# EAGLE design Rev1.0 (EAGLE 8.7.1)
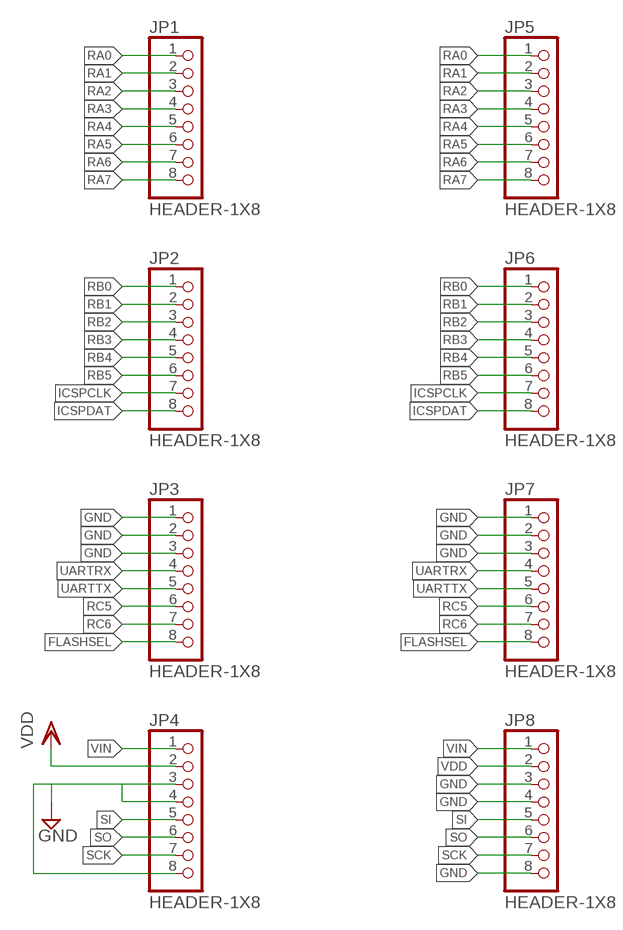
[diagram p0: schematic, sheet 1]

## Parts
JP1  HEADER-1X8  [1X08]
JP2  HEADER-1X8  [1X08]
JP3  HEADER-1X8  [1X08]
JP4  HEADER-1X8  [1X08]
JP5  HEADER-1X8  [1X08]
JP6  HEADER-1X8  [1X08]
JP7  HEADER-1X8  [1X08]
JP8  HEADER-1X8  [1X08]

## Nets
FLASHSEL: JP3.8 JP7.8
GND: JP3.1 JP3.2 JP3.3 JP4.3 JP4.4 JP4.8 JP7.1 JP7.2 JP7.3 JP8.3 JP8.4 JP8.8
ICSPCLK: JP2.7 JP6.7
ICSPDAT: JP2.8 JP6.8
RA0: JP1.1 JP5.1
RA1: JP1.2 JP5.2
RA2: JP1.3 JP5.3
RA3: JP1.4 JP5.4
RA4: JP1.5 JP5.5
RA5: JP1.6 JP5.6
RA6: JP1.7 JP5.7
RA7: JP1.8 JP5.8
RB0: JP2.1 JP6.1
RB1: JP2.2 JP6.2
RB2: JP2.3 JP6.3
RB3: JP2.4 JP6.4
RB4: JP2.5 JP6.5
RB5: JP2.6 JP6.6
RC5: JP3.6 JP7.6
RC6: JP3.7 JP7.7
SCK: JP4.7 JP8.7
SI: JP4.5 JP8.5
SO: JP4.6 JP8.6
UARTRX: JP3.4 JP7.4
UARTTX: JP3.5 JP7.5
VDD: JP4.2 JP8.2
VIN: JP4.1 JP8.1

## Library data of the parts
JP1-JP8 = lib-works:HEADER-1X8

## Board
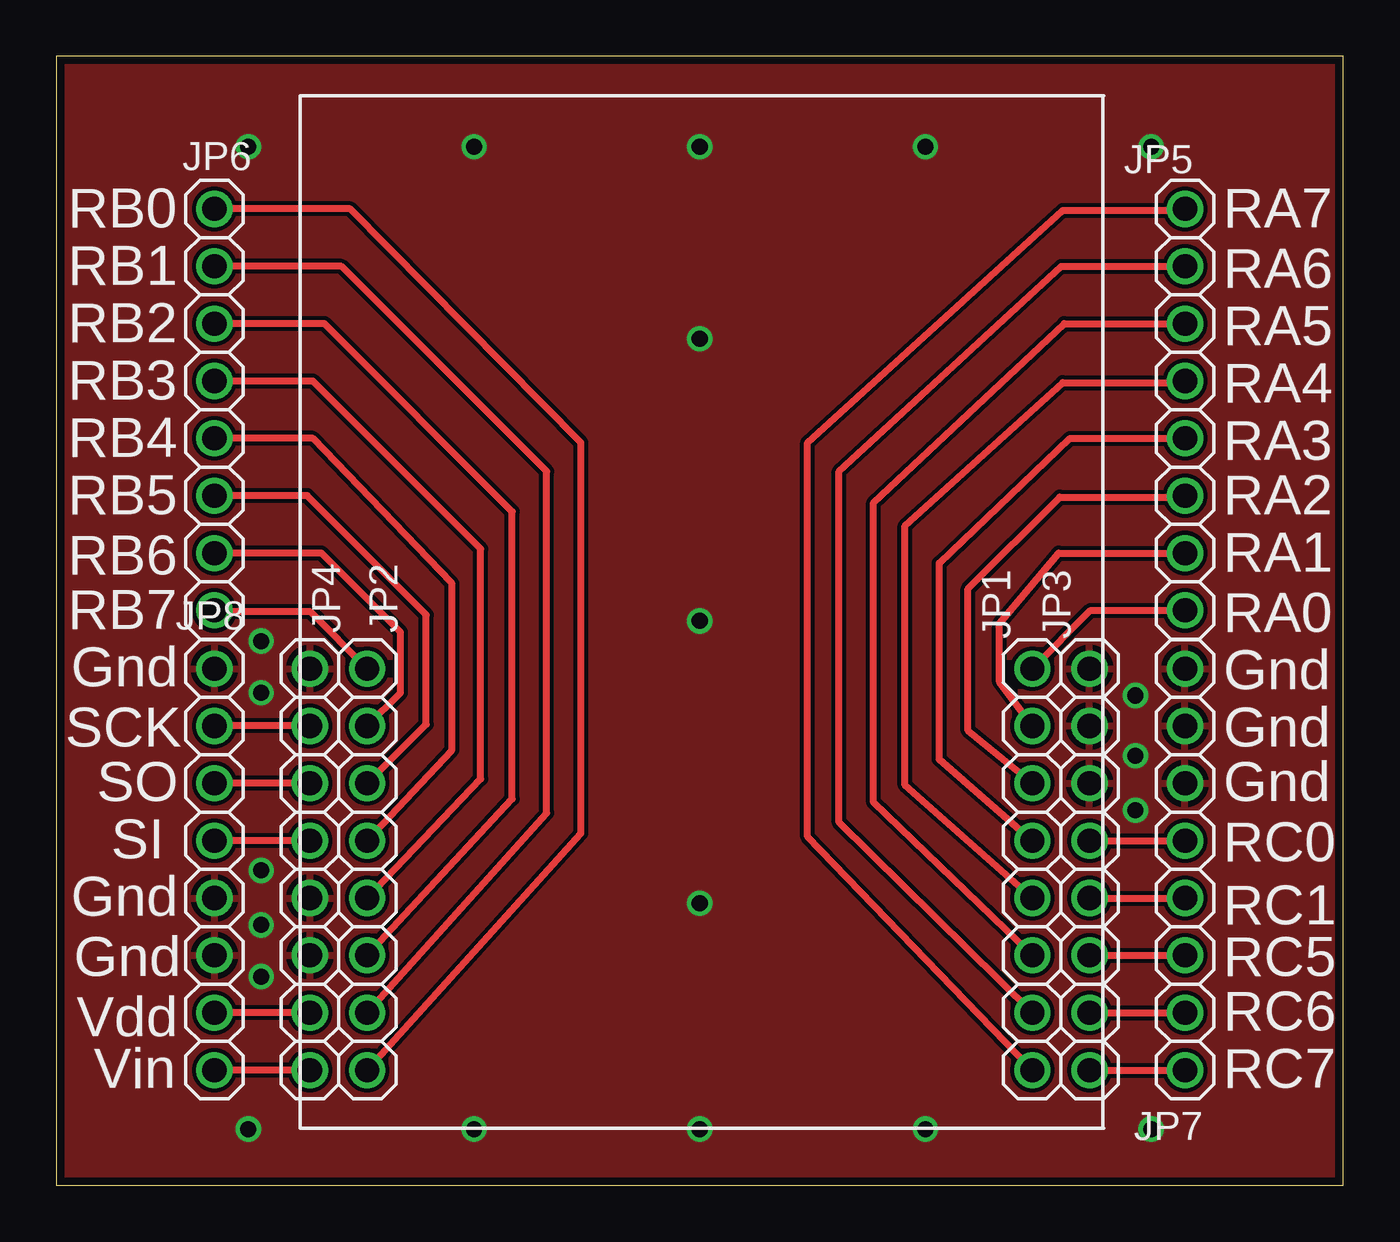
[diagram p1: board, top side]
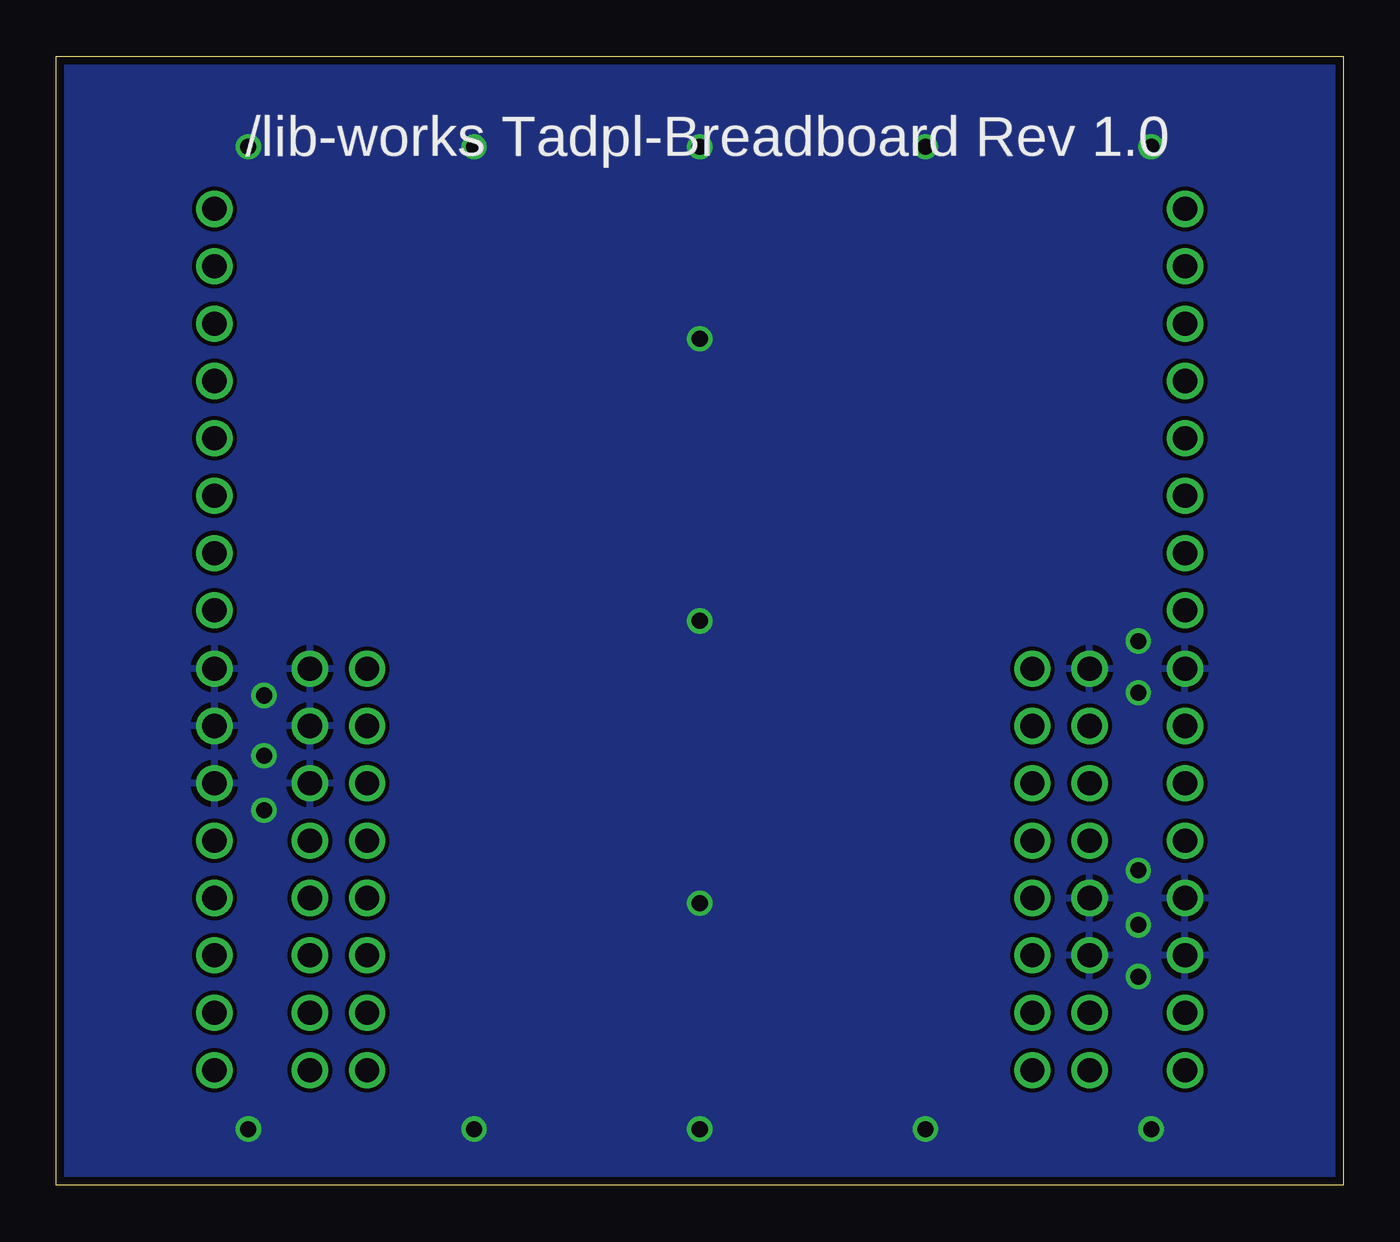
[diagram p2: board, bottom side, seen from below]

Size 57 x 50 mm. Coordinates in mm from the lower left corner, seen from the top.
Outline: 0,0 57,0 57,50 0,50 0,0
Copper layers (1*16): Top 0.035mm / dielectric 1.5mm / Bottom 0.035mm
Design rules "default *": minimum track width 7mil, minimum drill 0.35mm, track to track 7mil, track to pad 7mil, pad to pad 7mil, via to via 7mil, smd to smd 7mil, copper to edge 14mil, drill to drill 6mil, minimum pad ring 10mil, minimum via ring 8mil, stop-mask expansion 4mil, vias tented up to drill 0mil, thermal gap 10mil

### Footprints (pad centres in the part's own frame; a part is rotated, then mirrored left to right if it is on the bottom)
1X08 = drill 1.067: 1 -8.89,0; 2 -6.35,0; 3 -3.81,0; 4 -1.27,0; 5 1.27,0; 6 3.81,0; 7 6.35,0; 8 8.89,0

### Placement (x,y rotation side)
JP1  43.23,14 270 top
JP2  13.77,14 90 top
JP3  45.77,14 270 top
JP4  11.23,14 90 top
JP5  50,34.36 90 top
JP6  7,34.36 270 top
JP7  50,14 270 top
JP8  7,14 90 top

### Tracks (layer width: path | path; a pad name or v marks a point on that pad's centre or on a via)
FLASHSEL
  Top 0.305: JP3.8 JP7.8
GND  (via drill 0.71)
  other vias: 28.5,46 18.5,46 8.5,46 38.5,46 48.5,46 28.5,37.5 28.5,25 28.5,12.5 8.5,2.5 18.5,2.5 28.5,2.5 38.5,2.5 48.5,2.5 47.8,21.7 47.8,19.03 47.8,16.62 9.07,24.11 9.07,21.82 9.07,13.95 9.07,11.54 9.07,9.25
  pour Bottom: -2.16,51.44 -2.16,-2.29 58.55,-2.03 58.55,51.44
  pour Top: -1.91,51.56 -1.91,-1.91 59.44,-1.91 59.44,51.56
ICSPCLK
  Top 0.305: JP2.7 15.24,21.82 15.24,24.51 11.74,28.01 JP6.7
ICSPDAT
  Top 0.305: JP2.8 11.26,25.4 7.07,25.4 JP6.8
RA0
  Top 0.305: JP1.1 45.81,25.47 JP5.1
RA1
  Top 0.305: JP1.2 41.78,22.3 41.78,24.89 44.39,28.01 JP5.2
RA2
  Top 0.305: JP1.3 40.39,20.15 40.39,26.42 44.45,30.48 49.93,30.48 JP5.3
RA3
  Top 0.305: JP1.4 39.12,18.88 39.12,27.56 44.9,33.09 JP5.4
RA4
  Top 0.305: JP1.5 37.59,17.73 37.59,29.21 44.58,35.56 49.93,35.56 JP5.5
RA5
  Top 0.305: JP1.6 36.2,16.97 36.2,30.23 44.64,38.17 JP5.6
RA6
  Top 0.305: JP1.7 34.67,16.08 34.67,31.62 44.52,40.71 JP5.7
RA7
  Top 0.305: JP1.8 33.27,15.45 33.27,32.89 44.58,43.18 49.93,43.18 JP5.8
RB0
  Top 0.305: JP2.1 23.24,15.6 23.24,32.89 13.01,43.25 JP6.1
RB1
  Top 0.305: JP2.2 21.72,16.49 21.72,31.62 12.63,40.71 JP6.2
RB2
  Top 0.305: JP2.3 20.19,17.12 20.19,29.84 11.87,38.17 JP6.3
RB3
  Top 0.305: JP2.4 18.8,18.01 18.8,28.19 11.36,35.63 JP6.4
RB4
  Top 0.305: JP2.5 17.53,19.28 17.53,26.67 11.36,33.09 JP6.5
RB5
  Top 0.305: JP2.6 16.38,20.42 16.38,25.27 11.11,30.55 JP6.6
RC5
  Top 0.305: JP3.6 JP7.6
RC6
  Top 0.305: JP3.7 JP7.7
SCK
  Top 0.305: JP4.7 JP8.7
SI
  Top 0.305: JP4.5 JP8.5
SO
  Top 0.305: JP4.6 JP8.6
UARTRX
  Top 0.305: JP3.4 JP7.4
UARTTX
  Top 0.305: JP3.5 JP7.5
VDD
  Top 0.305: JP4.2 JP8.2
VIN
  Top 0.305: JP4.1 JP8.1

### Text on the board
tPlace: RB0 | RA7 | RB1 | RA6 | RB2 | RA5 | RB3 | RA4 | RB4 | RA3 | RB5 | RA2 | RB6 | RA1 | RB7 | RA0 | Gnd | Gnd | SCK | Gnd | SO | Gnd | SI | RC0 | Gnd | RC1 | Gnd | RC5 | Vdd | RC6 | Vin | RC7
bPlace: /lib-works Tadpl-Breadboard Rev 1.0